# Altium schematic sheet RELAY_8CH.SchDoc
size A; SheetNumber: 4; SheetTotal: 5
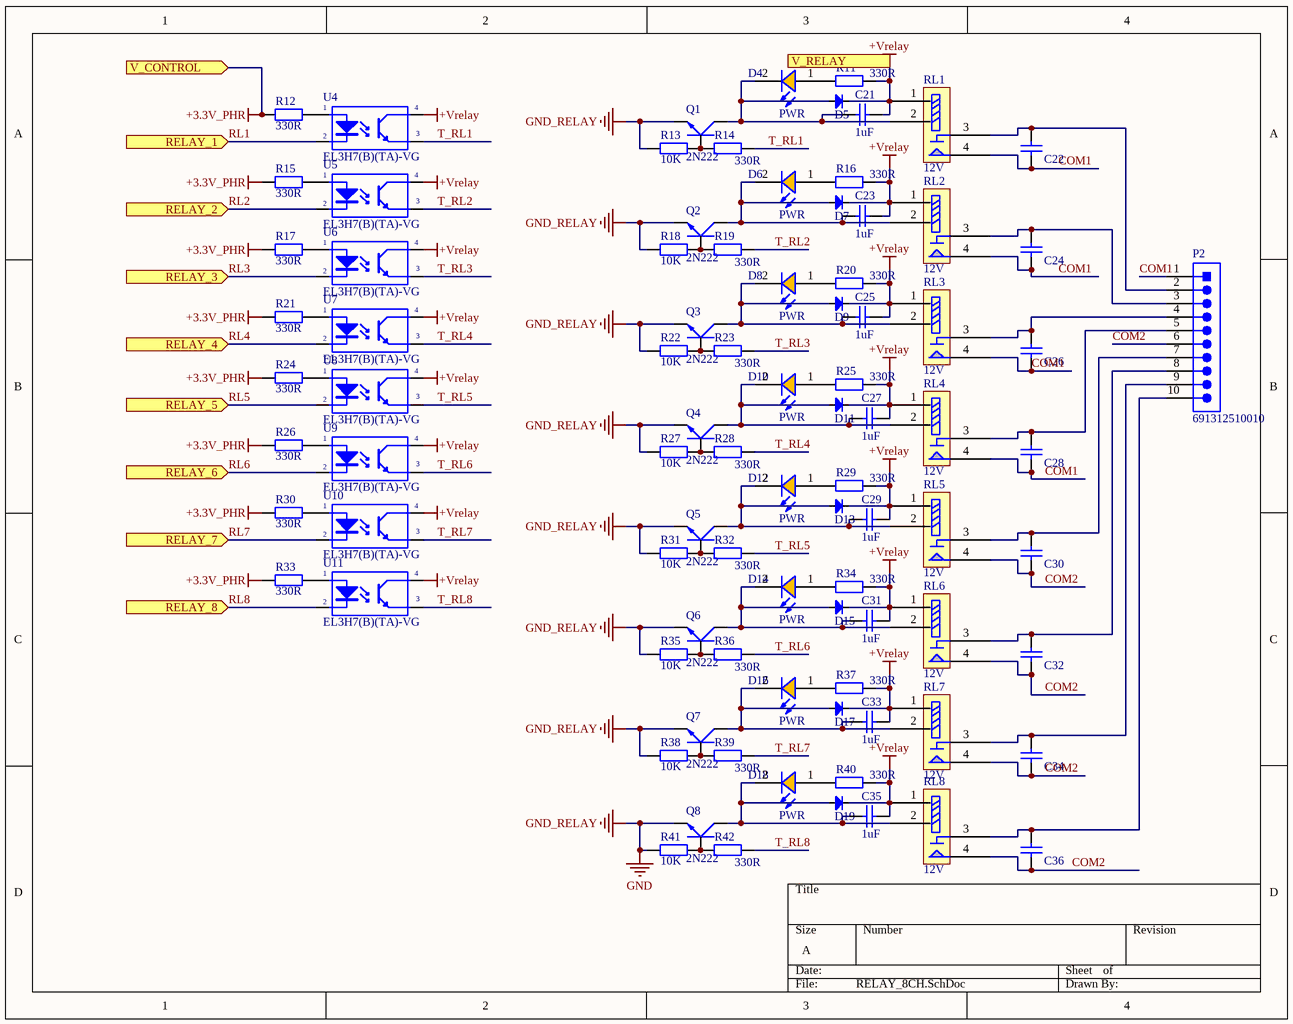
[diagram p0: RELAY_8CH.SchDoc]

## Parts
C21  1uF  [CAP_0805]
C22  R82DC3100DQ50J  [CAP FILM 5mm]  (value not drawn)
C23  1uF  [CAP_0805]
C24  R82DC3100DQ50J  [CAP FILM 5mm]  (value not drawn)
C25  1uF  [CAP_0805]
C26  R82DC3100DQ50J  [CAP FILM 5mm]  (value not drawn)
C27  1uF  [CAP_0805]
C28  R82DC3100DQ50J  [CAP FILM 5mm]  (value not drawn)
C29  1uF  [CAP_0805]
C30  R82DC3100DQ50J  [CAP FILM 5mm]  (value not drawn)
C31  1uF  [CAP_0805]
C32  R82DC3100DQ50J  [CAP FILM 5mm]  (value not drawn)
C33  1uF  [CAP_0805]
C34  R82DC3100DQ50J  [CAP FILM 5mm]  (value not drawn)
C35  1uF  [CAP_0805]
C36  R82DC3100DQ50J  [CAP FILM 5mm]  (value not drawn)
D4  PWR  [WL-SMCW_0603_L1.6W0.8H0.7]
D5  Diode SMD  [DIO-SMD-106]  (value not drawn)
D6  PWR  [WL-SMCW_0603_L1.6W0.8H0.7]
D7  Diode SMD  [DIO-SMD-106]  (value not drawn)
D8  PWR  [WL-SMCW_0603_L1.6W0.8H0.7]
D9  Diode SMD  [DIO-SMD-106]  (value not drawn)
D10  PWR  [WL-SMCW_0603_L1.6W0.8H0.7]
D11  Diode SMD  [DIO-SMD-106]  (value not drawn)
D12  PWR  [WL-SMCW_0603_L1.6W0.8H0.7]
D13  Diode SMD  [DIO-SMD-106]  (value not drawn)
D14  PWR  [WL-SMCW_0603_L1.6W0.8H0.7]
D15  Diode SMD  [DIO-SMD-106]  (value not drawn)
D16  PWR  [WL-SMCW_0603_L1.6W0.8H0.7]
D17  Diode SMD  [DIO-SMD-106]  (value not drawn)
D18  PWR  [WL-SMCW_0603_L1.6W0.8H0.7]
D19  Diode SMD  [DIO-SMD-106]  (value not drawn)
P2  691312510010  [691312510010]
Q1  2N222  [SOT23-231]
Q2  2N222  [SOT23-231]
Q3  2N222  [SOT23-231]
Q4  2N222  [SOT23-231]
Q5  2N222  [SOT23-231]
Q6  2N222  [SOT23-231]
Q7  2N222  [SOT23-231]
Q8  2N222  [SOT23-231]
R11  330R  [RES_0603]
R12  330R  [RES_0603]
R13  10K  [RES_0603]
R14  330R  [RES_0603]
R15  330R  [RES_0603]
R16  330R  [RES_0603]
R17  330R  [RES_0603]
R18  10K  [RES_0603]
R19  330R  [RES_0603]
R20  330R  [RES_0603]
R21  330R  [RES_0603]
R22  10K  [RES_0603]
R23  330R  [RES_0603]
R24  330R  [RES_0603]
R25  330R  [RES_0603]
R26  330R  [RES_0603]
R27  10K  [RES_0603]
R28  330R  [RES_0603]
R29  330R  [RES_0603]
R30  330R  [RES_0603]
R31  10K  [RES_0603]
R32  330R  [RES_0603]
R33  330R  [RES_0603]
R34  330R  [RES_0603]
R35  10K  [RES_0603]
R36  330R  [RES_0603]
R37  330R  [RES_0603]
R38  10K  [RES_0603]
R39  330R  [RES_0603]
R40  330R  [RES_0603]
R41  10K  [RES_0603]
R42  330R  [RES_0603]
RL1  12V  [HF46F]
RL2  12V  [HF46F]
RL3  12V  [HF46F]
RL4  12V  [HF46F]
RL5  12V  [HF46F]
RL6  12V  [HF46F]
RL7  12V  [HF46F]
RL8  12V  [HF46F]
U4  Part Number: EL3H7(B)(TA)-VG  [Everlight_EL3H7_B_TA_-VG_0]  (hidden comment: UNK_Everlight_EL3H7_B_TA_-VG_eec)
U5  Part Number: EL3H7(B)(TA)-VG  [Everlight_EL3H7_B_TA_-VG_0]  (hidden comment: UNK_Everlight_EL3H7_B_TA_-VG_eec)
U6  Part Number: EL3H7(B)(TA)-VG  [Everlight_EL3H7_B_TA_-VG_0]  (hidden comment: UNK_Everlight_EL3H7_B_TA_-VG_eec)
U7  Part Number: EL3H7(B)(TA)-VG  [Everlight_EL3H7_B_TA_-VG_0]  (hidden comment: UNK_Everlight_EL3H7_B_TA_-VG_eec)
U8  Part Number: EL3H7(B)(TA)-VG  [Everlight_EL3H7_B_TA_-VG_0]  (hidden comment: UNK_Everlight_EL3H7_B_TA_-VG_eec)
U9  Part Number: EL3H7(B)(TA)-VG  [Everlight_EL3H7_B_TA_-VG_0]  (hidden comment: UNK_Everlight_EL3H7_B_TA_-VG_eec)
U10  Part Number: EL3H7(B)(TA)-VG  [Everlight_EL3H7_B_TA_-VG_0]  (hidden comment: UNK_Everlight_EL3H7_B_TA_-VG_eec)
U11  Part Number: EL3H7(B)(TA)-VG  [Everlight_EL3H7_B_TA_-VG_0]  (hidden comment: UNK_Everlight_EL3H7_B_TA_-VG_eec)

## Ports
RELAY_1 (in), RELAY_2 (in), RELAY_3 (in), RELAY_4 (in), RELAY_5 (in), RELAY_6 (in), RELAY_7 (in), RELAY_8 (in), V_CONTROL (in), V_RELAY (in)

## Nets
+3.3V_PHR: R12.1 R15.1 R17.1 R21.1 R24.1 R26.1 R30.1 R33.1 ; port V_CONTROL
+Vrelay: C21.1 C23.1 C25.1 C27.1 C29.1 C31.1 C33.1 C35.1 D5.2(K) D7.2(K) D9.2(K) D11.2(K) D13.2(K) D15.2(K) D17.2(K) D19.2(K) R11.1 R16.1 R20.1 R25.1 R29.1 R34.1 R37.1 R40.1 RL1.1 RL2.1 RL3.1 RL4.1 RL5.1 RL6.1 RL7.1 RL8.1 U4.4(C) U5.4(C) U6.4(C) U7.4(C) U8.4(C) U9.4(C) U10.4(C) U11.4(C)
GND: Q1.1(E) Q2.1(E) Q3.1(E) Q4.1(E) Q5.1(E) Q6.1(E) Q7.1(E) Q8.1(E) R13.1 R18.1 R22.1 R27.1 R31.1 R35.1 R38.1 R41.1  [also labelled GND_RELAY]
COM1: C22.2 C24.2 C26.2 C28.2 P2.1 RL1.4 RL2.4 RL3.4 RL4.4
COM2: C30.2 C32.2 C34.2 C36.2 P2.6 RL5.4 RL6.4 RL7.4 RL8.4
RL1: U4.2(K) ; port RELAY_1
RL2: U5.2(K) ; port RELAY_2
RL3: U6.2(K) ; port RELAY_3
RL4: U7.2(K) ; port RELAY_4
RL5: U8.2(K) ; port RELAY_5
RL6: U9.2(K) ; port RELAY_6
RL7: U10.2(K) ; port RELAY_7
RL8: U11.2(K) ; port RELAY_8
T_RL1: R14.2 U4.3(E)
T_RL2: R19.2 U5.3(E)
T_RL3: R23.2 U6.3(E)
T_RL4: R28.2 U7.3(E)
T_RL5: R32.2 U8.3(E)
T_RL6: R36.2 U9.3(E)
T_RL7: R39.2 U10.3(E)
T_RL8: R42.2 U11.3(E)
NetC21_2: C21.2 D4.2(K) D5.1(A) Q1.3(C) RL1.2
NetC22_1: C22.1 P2.2 RL1.3
NetC23_2: C23.2 D6.2(K) D7.1(A) Q2.3(C) RL2.2
NetC24_1: C24.1 P2.3 RL2.3
NetC25_2: C25.2 D8.2(K) D9.1(A) Q3.3(C) RL3.2
NetC26_1: C26.1 P2.4 RL3.3
NetC27_2: C27.2 D10.2(K) D11.1(A) Q4.3(C) RL4.2
NetC28_1: C28.1 P2.5 RL4.3
NetC29_2: C29.2 D12.2(K) D13.1(A) Q5.3(C) RL5.2
NetC30_1: C30.1 P2.7 RL5.3
NetC31_2: C31.2 D14.2(K) D15.1(A) Q6.3(C) RL6.2
NetC32_1: C32.1 P2.8 RL6.3
NetC33_2: C33.2 D16.2(K) D17.1(A) Q7.3(C) RL7.2
NetC34_1: C34.1 P2.9 RL7.3
NetC35_2: C35.2 D18.2(K) D19.1(A) Q8.3(C) RL8.2
NetC36_1: C36.1 P2.10 RL8.3
NetD4_1: D4.1(A) R11.2
NetD6_1: D6.1(A) R16.2
NetD8_1: D8.1(A) R20.2
NetD10_1: D10.1(A) R25.2
NetD12_1: D12.1(A) R29.2
NetD14_1: D14.1(A) R34.2
NetD16_1: D16.1(A) R37.2
NetD18_1: D18.1(A) R40.2
NetQ1_2: Q1.2(B) R13.2 R14.1
NetQ2_2: Q2.2(B) R18.2 R19.1
NetQ3_2: Q3.2(B) R22.2 R23.1
NetQ4_2: Q4.2(B) R27.2 R28.1
NetQ5_2: Q5.2(B) R31.2 R32.1
NetQ6_2: Q6.2(B) R35.2 R36.1
NetQ7_2: Q7.2(B) R38.2 R39.1
NetQ8_2: Q8.2(B) R41.2 R42.1
NetR12_2: R12.2 U4.1(A)
NetR15_2: R15.2 U5.1(A)
NetR17_2: R17.2 U6.1(A)
NetR21_2: R21.2 U7.1(A)
NetR24_2: R24.2 U8.1(A)
NetR26_2: R26.2 U9.1(A)
NetR30_2: R30.2 U10.1(A)
NetR33_2: R33.2 U11.1(A)

## Library data of the parts
C21 C23 C25 C27 C29 C31 C33 C35 = CAP_SMD: WCAP-CSGP General Purpose Ceramic Capacitors; Part Number: 885012005001; Rated Voltage: 10VDC; Isolation Resistance: >=10GOhm; Ceramic Type: NP0; Capacitance Tolerance: +/-0.5pF; Dissipation Factor: Q>=400+20C; Capacitance: 1pF; Technical Reference: NP004021R0D010DFCT10000; ComponentLink1Description: Manufacturer; ComponentLink1URL: http://www.we-online.de; ComponentLink2Description: Datasheet; ComponentLink2URL: https://katalog.we-online.com/pbs/datasheet/885012005001.pdf; Operating Temperature: -55 to +125degC; Packaging: Tape and Reel; Publisher: Wurth Elektronik; Published Date: August 2019; Height: 0.5mm +/-0.05mm; Mounting Technology: SMT; Size: 0402
C22 C24 C26 C28 C30 C32 C34 C36 = CAP FILM: R82, Film, Metallized Polyester Stacked, Automotive Grade, 0.1 uF, 5%, 40 VAC, 63 VDC, 105C, -55C, 85C, 0.8 % , 15 GOhms, 160 V/us, 7000 pH, 0.214 g, 7.2mm, 6.5mm, 2.5mm, Lead Spacing = 5mm, 3500; Manufacturer_Name: KEMET; Manufacturer_Part_Number: R82DC3100DQ50J; Mouser Part Number: 80-R82DC3100DQ50J; Mouser Price/Stock: https://www.mouser.co.uk/ProductDetail/KEMET/R82DC3100DQ50J?qs=06HLYMEcjuXxjUSf9lh2BQ%3D%3D; Arrow Part Number: R82DC3100DQ50J; Arrow Price/Stock: https://www.arrow.com/en/products/r82dc3100dq50j/kemet-corporation?region=europe; Datasheet Link: https://content.kemet.com/datasheets/KEM_F3101_R82.pdf
D4 D6 D8 D10 D12 D14 D16 D18 = 150060AS75003: WL-SMCW SMT Mono-color Chip LED Waterclear, size 0603, Amber, 2V, 140°; Manufacturer: Wurth Elektronik; Chip Technology: AlInGaP; Dominant Wavelength: 605nm; Luminous Intensity: 350mcd; Peak Wavelength: 610nm; ComponentLink1Description: Manufacturer Link; ComponentLink1URL: http://www.we-online.de; ComponentLink2Description: Datasheet; ComponentLink2URL: https://www.we-online.com/catalog/datasheet/150060AS75003.pdf; Emitting Color: Amber; Forward Voltage: 2V; Height: 0.7mm; Length: 1.6mm; Manufacturer Part Number: 150060AS75003; Mounting Technology: SMT; Operating Temperature max.: 100C; Operating Temperature min.: -40C; Packaging: Tape and Reel; Size: 0603; Viewing Angle: 140°; Width: 0.8mm
D5 D7 D9 D11 D13 D15 D17 D19 = Diode SMD: Default Diode; Code - JEDEC: DO-214-AB; Value: 1N5007; Published: 8-Jun-2000; Revision: July-2002: Re-released for DXP Platform.; Publisher: Altium Limited
P2 = 691312510010: WR-TBL Serie 312 Open Horizontal PCB Header, Pluggable, THT, pitch 5.08mm, 10p; Manufacturer: Wurth Elektronik; Modularity: No; Pin Number: 10; Rated Current [UL]: 20A; Working Voltage [UL]: 300VAC; ComponentLink1Description: Manufacturer; ComponentLink1URL: http://www.we-online.de; ComponentLink2URL: https://katalog.we-online.de/em/datasheet/691312510010.pdf; ComponentLink2Description: Datasheet; Mounting Technology: THT; Manufacturer Part Number: 691312510010; Packaging: Box; Operating Temperature: -40 to +105degC; PCB/Cable/Panel: PCB; Pitch: 5.08mm; Published Date: Feburary 2021; Type: Horizontal; Application: Pluggable
Q1-Q8 = 2N222: NPN 600mW, ECB; Value: C1815
R11-R42 = RES_SMD: WRIS-KSKE SMT Thick Film Resistor, 0.125W; Manufacturer: Wurth Elektronik; Manufacturer Part Number: 560050310010; Rated Current: 0.5A; Resistance: 0.5Ohm; Temperature Coefficient of Resistance: 200ppm/degC; Technical Reference: KE0402R500F108HAATH0000; Resistance Tolerance: +/-1%; ComponentLink1Description: Manufacturer; ComponentLink1URL: http://www.we-online.de; ComponentLink2Description: Datasheet; ComponentLink2URL: https://www.we-online.com/catalog/datasheet/560050310010.pdf; Published Date: May 2020; Rated Power: 0.125W; Height: 0.35mm; Operating Temperature: -55 to +155degC; Mounting Technology: SMT; Packaging: Tape and Reel; Size: 0402; Length: 1mm; Width: 0.5mm
RL1-RL8 = HONGFA HF46F: Relay 5V HF46F
U4-U11 = UNK_Everlight_EL3H7_B_TA_-VG_eec: UNK OPTOISOLATOR 3.75KV TRANS 4-SSOP; helpURL: https://upverter.com/upn/revision/a68dfb3988c96dc5/; ComponentLink2Description: Datasheet; Temperature: -55°C to +110°C; Package: SSOP4; Supplier 2: Mouser; Price: 0.304404184647; Supplier 1: Digi-Key; ComponentLink1URL: https://upverter.com/upn/revision/a68dfb3988c96dc5/; Supplier Part Number 2: 638-EL3H7BTAVG; Supplier Part Number 1: 1080-1197-1-ND; Manufacturer: Everlight; ComponentLink1Description: Upverter; ComponentLink2URL: http://www.everlight.com/datasheets/EL3H7_G.pdf; RoHS: TRUE; Mouser Part Number: 638-EL3H7BTAVG; Ipc Land Pattern Name: CAPC16080X45; Temperature Range High: +110°C; Digikey Description: UNK OPTOISOLATOR 3.75KV TRANS 4-SSOP; Digikey Part Number: 1080-1197-1-ND; Lead Free: yes; Temperature Range Low: -55°C